# Altium project max232.PrjPcb
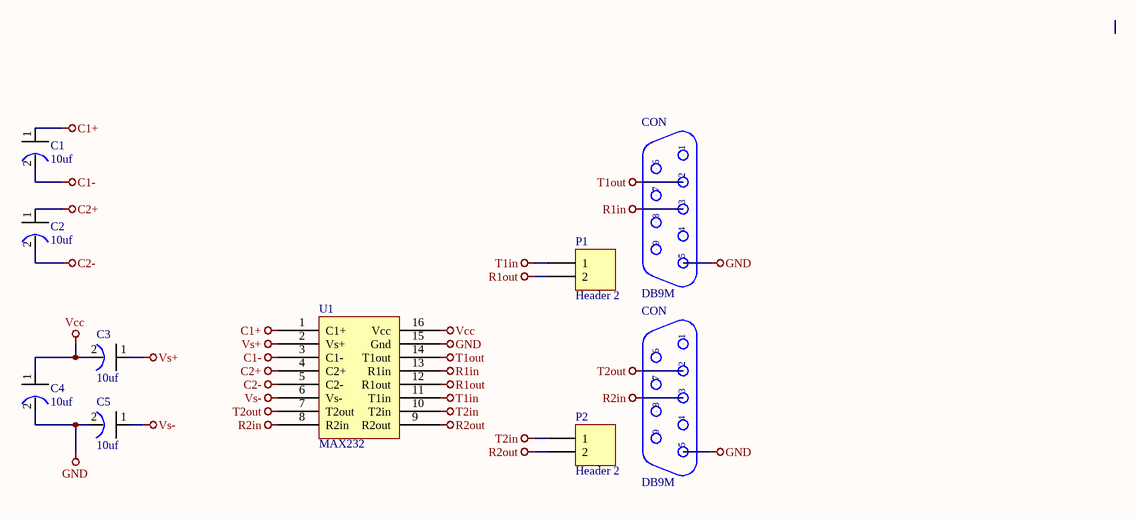
[diagram p0: Max232schematic.SchDoc]
1 sheet, 10 parts. Net scope: global (net labels, ports and power ports of the same name join across sheets).
Board file: PCB1.PcbDoc

## Sheet Max232schematic.SchDoc
size A

### Parts
(Parts that share a designator on the sheet are numbered #1, #2 ... from top to bottom, then left to right.)
C1  10uf  [capacitor]
C2  10uf  [capacitor]
C3  10uf  [capacitor]
C4  10uf  [capacitor]
C5  10uf  [capacitor]
CON#1  DB9M  [D-09M]
CON#2  DB9M  [D-09M]
P1  Header 2  [HDR1X2]
P2  Header 2  [HDR1X2]
U1  MAX232  [MAX232]

### Nets
C1+: C1.1 U1.1(C1+)
C1-: C1.2 U1.3(C1-)
C2+: C2.1 U1.4(C2+)
C2-: C2.2 U1.5(C2-)
GND: C4.2 C5.2 CON#1.5 CON#2.5 U1.15(Gnd)
R1in: CON#1.3 U1.13(R1in)
R1out: P1.2 U1.12(R1out)
R2in: CON#2.3 U1.8(R2in)
R2out: P2.2 U1.9(R2out)
T1in: P1.1 U1.11(T1in)
T1out: CON#1.2 U1.14(T1out)
T2in: P2.1 U1.10(T2in)
T2out: CON#2.2 U1.7(T2out)
Vcc: C3.2 C4.1 U1.16(Vcc)
Vs+: C3.1 U1.2(Vs+)
Vs-: C5.1 U1.6(Vs-)

Not connected (* = marked no-connect by the designer): CON#1 1 4 6 7 8 9; CON#2 1 4 6 7 8 9

### Library data of the parts
C1-C5 = capacitor
CON#1 CON#2 = DB9M: Adapter Connector D-Sub, 9 Pin Male To D-Sub, 9 Pin Male Free Hanging _In-Line_; MF: NorComp Inc.; Package: None; Price: None; MP: DB9M; Availability: Unavailable; SnapEDA_Link: https://www.snapeda.com/parts/DB9M/NorComp%20Inc./view-part/558713/?ref=snap; Value: *
P1 P2 = Header 2: Header, 2-Pin; LatestRevisionDate: 17-Jul-2002; LatestRevisionNote: Re-released for DXP Platform.; Publisher: Altium Limited